# Altium schematic sheet Core.SchDoc
size A4; SheetNumber: 1; SheetTotal: 3
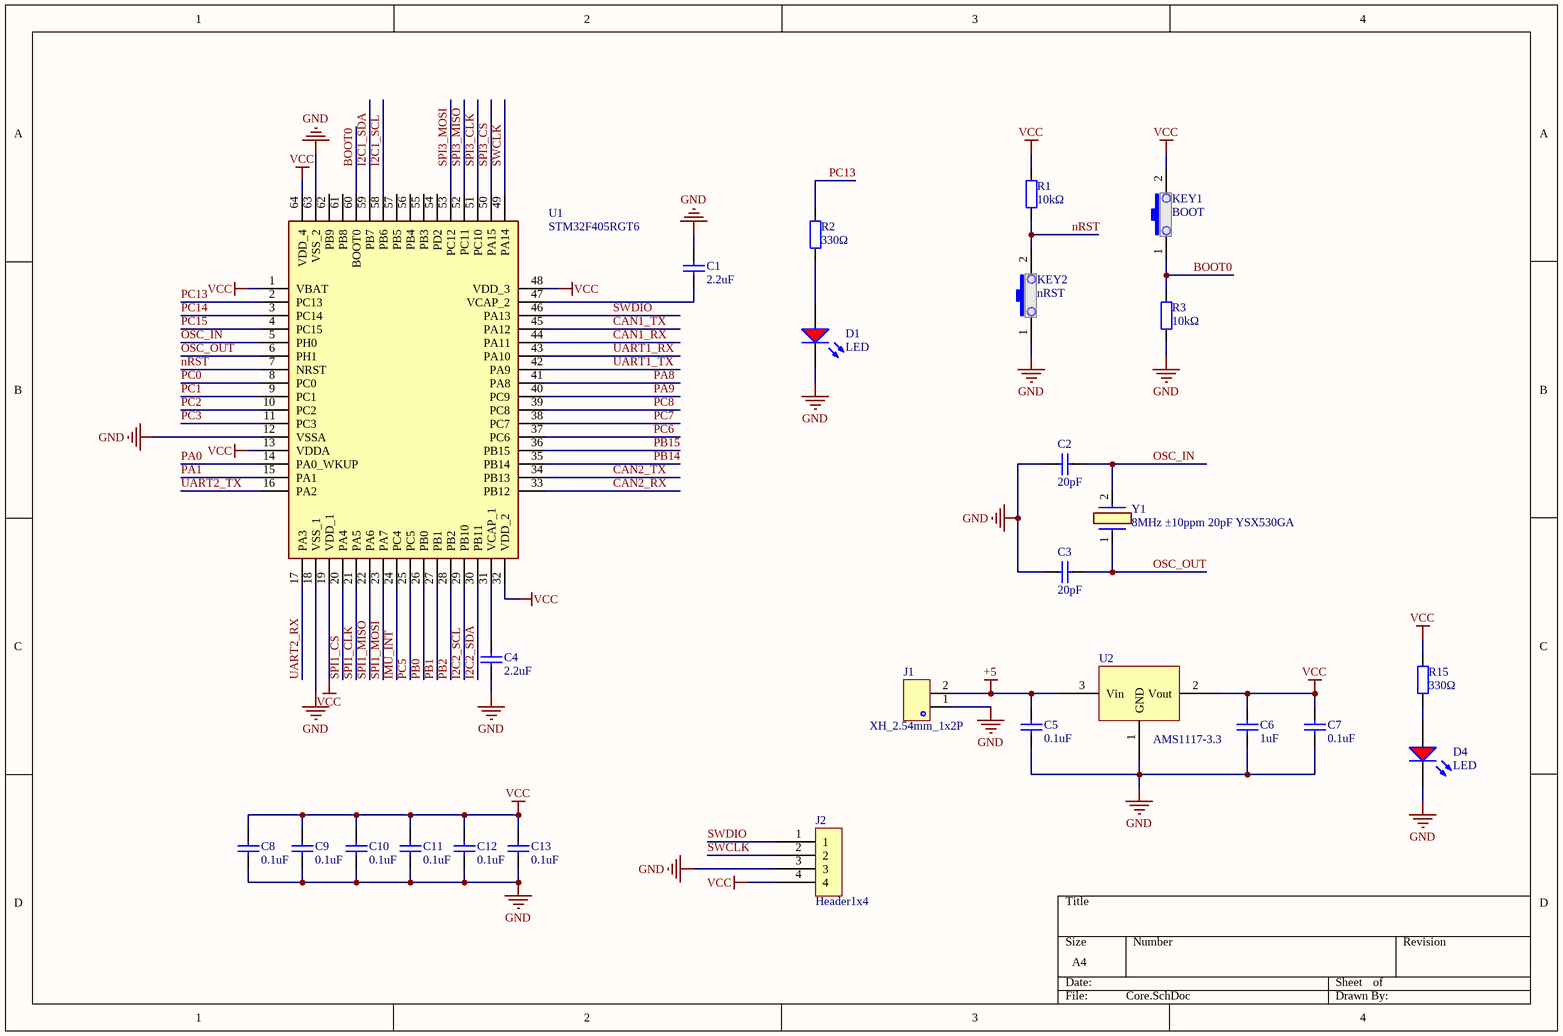
[diagram p0: Core.SchDoc]

## Parts
C1  2.2uF  [C0603]
C2  20pF  [C0603]
C3  20pF  [C0603]
C4  2.2uF  [C0603]
C5  0.1uF  [C0603]
C6  1uF  [C0603]
C7  0.1uF  [C0603]
C8  0.1uF  [C0603]
C9  0.1uF  [C0603]
C10  0.1uF  [C0603]
C11  0.1uF  [C0603]
C12  0.1uF  [C0603]
C13  0.1uF  [C0603]
D1  LED  [0603_LED_S1]
D4  LED  [0603_LED_S1]
J1  XH_2.54mm_1x2P  [XH2.54mm1x2P弯插]
J2  Header1x4  [Header 1x4p]
KEY1  BOOT  [KEY_3*4]
KEY2  nRST  [KEY_3*4]
R1  10kΩ  [R0603]
R2  330Ω  [R0603]
R3  10kΩ  [R0603]
R15  330Ω  [R0603]
U1  STM32F405RGT6  [QFP50P1200X1200X160-64N]
U2  AMS1117-3.3  [SOT-223]
Y1  8MHz ±10ppm 20pF YSX530GA  [X503212MSB2GI]

## Nets
+5: C5.2 J1.2 U2.3(Vin)
GND: C1.2 C2.2 C3.2 C4.2 C5.1 C6.1 C7.1 C8.1 C9.1 C10.1 C11.1 C12.1 C13.1 D1.K D4.K J1.1 J2.3 KEY2.1 R3.1 U1.12(VSSA) U1.18(VSS_1) U1.63(VSS_2) U2.1(GND)
VCC: C6.2 C7.2 C8.2 C9.2 C10.2 C11.2 C12.2 C13.2 J2.4 KEY1.2 R1.2 R15.1 U1.1(VBAT) U1.13(VDDA) U1.19(VDD_1) U1.32(VDD_2) U1.48(VDD_3) U1.64(VDD_4) U2.2(Vout)
BOOT0: KEY1.1 R3.2 U1.60(BOOT0)
CAN1_RX: U1.44(PA11)
CAN1_TX: U1.45(PA12)
CAN2_RX: U1.33(PB12)
CAN2_TX: U1.34(PB13)
I2C1_SCL: U1.58(PB6)
I2C1_SDA: U1.59(PB7)
I2C2_SCL: U1.29(PB10)
I2C2_SDA: U1.30(PB11)
IMU_INT: U1.24(PC4)
nRST: KEY2.2 R1.1 U1.7(NRST)
OSC_IN: C2.1 U1.5(PH0) Y1.2
OSC_OUT: C3.1 U1.6(PH1) Y1.1
PA0: U1.14(PA0_WKUP)
PA1: U1.15(PA1)
PA8: U1.41(PA8)
PA9: U1.40(PC9)
PB0: U1.26(PB0)
PB1: U1.27(PB1)
PB2: U1.28(PB2)
PB14: U1.35(PB14)
PB15: U1.36(PB15)
PC0: U1.8(PC0)
PC1: U1.9(PC1)
PC2: U1.10(PC2)
PC3: U1.11(PC3)
PC5: U1.25(PC5)
PC6: U1.37(PC6)
PC7: U1.38(PC7)
PC8: U1.39(PC8)
PC13: R2.1 U1.2(PC13)
PC14: U1.3(PC14)
PC15: U1.4(PC15)
SPI1_CLK: U1.21(PA5)
SPI1_CS: U1.20(PA4)
SPI1_MISO: U1.22(PA6)
SPI1_MOSI: U1.23(PA7)
SPI3_CLK: U1.51(PC10)
SPI3_CS: U1.50(PA15)
SPI3_MISO: U1.52(PC11)
SPI3_MOSI: U1.53(PC12)
SWCLK: J2.2 U1.49(PA14)
SWDIO: J2.1 U1.46(PA13)
UART1_RX: U1.43(PA10)
UART1_TX: U1.42(PA9)
UART2_RX: U1.17(PA3)
UART2_TX: U1.16(PA2)
NetC1_1: C1.1 U1.47(VCAP_2)
NetC4_1: C4.1 U1.31(VCAP_1)
NetD1_A: D1.A R2.2
NetD4_A: D4.A R15.2

Not connected (* = marked no-connect by the designer): U1 54(PD2) 55(PB3) 56(PB4) 57(PB5) 61(PB8) 62(PB9)

## Library data of the parts
C1-C13 = Capacitor
D1 D4 = 0603 红灯: 发光二极管; ComponentLink1Description: 供应商链接; ComponentLink1URL: http://www.szlcsc.com/product/details_2659.html; Package: 0603; Supplier: LC; SuppliersPartNumber: C2286
KEY1 KEY2 = KEY_3*4: C707339
R1-R3 R15 = Resistor
U1 = STM32F405RGT6TR: Integrated Circuit; Manufacturer_Name: STMicroelectronics; Datasheet Link: http://www.st.com/web/en/resource/technical/document/datasheet/DM00037051.pdf; Height: 1.6mm; Manufacturer_Part_Number: STM32F405RGT6TR; Mouser Part Number: 511-STM32F405RGT6TR; Mouser Price/Stock: https://www.mouser.co.uk/ProductDetail/STMicroelectronics/STM32F405RGT6TR?qs=MavH1QghrkHshpR6GkvPIg%3D%3D; Arrow Part Number: STM32F405RGT6TR; Arrow Price/Stock: https://www.arrow.com/en/products/stm32f405rgt6tr/stmicroelectronics?region=nac
U2 = AMS1117-3.3: C347222
Y1 = X503212MSB2GI: Crystal or Oscillator; Manufacturer_Name: Yangxing Tech; Datasheet Link: https://datasheet.lcsc.com/szlcsc/Yangxing-Tech-X503212MSB2GI_C112573.pdf; Height: 1.35mm; Manufacturer_Part_Number: X503212MSB2GI